# Altium schematic sheet DCDCConverterUP.SchDoc
size 420 x 297 mm; Address1: Address1; Address2: Address2; Address3: Address3; Address4: Address4; SheetNumber: 1; Scale: 1:1; Разраб.: Лепотенко; Обозначение документа: ЛАС.4276435.001Э3; Перв. применение: ЛАС.4276435.001; Наименование изделия 1: DC-DC преобразователь; Наименование изделия 2: Схема электрическая; Наименование изделия 3: принципиальная; Нач. отд.: Нач. отд.
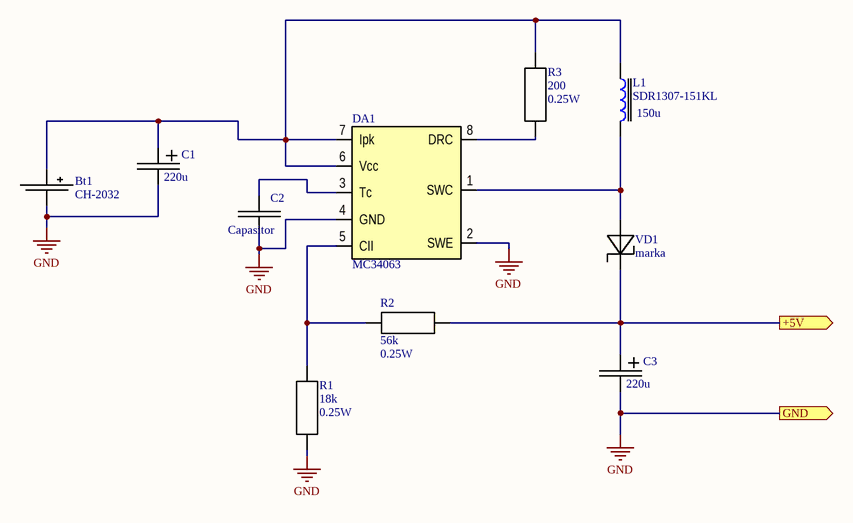
[diagram p0: DCDCConverterUP.SchDoc]

## Parts
Bt1  CH-2032  [CH25-2032]
C1  220u  [Type D]
C2  Capasitor  [CAP1206]
C3  220u  [Type D]
DA1  MC34063  [SO-8]
L1  SDR1307-151KL  value 150u  [SDR1307-151KL]
R1  value 18k  Power: 0.25W  [1206]  (hidden comment: Resistor)
R2  value 56k  Power: 0.25W  [1206]  (hidden comment: Resistor)
R3  value 200  Power: 0.25W  [1206]  (hidden comment: Resistor)
VD1  marka  [SOD-23]

## Ports
+5V (out), GND (out)

## Nets
GND: Bt1.2 C1.2 C2.2 C3.2 DA1.2(SWE) DA1.4(GND) R1.1 ; port GND
+5V: C3.1 R2.1 VD1.2 ; port +5V
NetBt1_1: Bt1.1 C1.1 DA1.6(Vcc) DA1.7(Ipk) L1.2 R3.2
NetC2_1: C2.1 DA1.3(Tc)
NetDA1_1: DA1.1(SWC) L1.1 VD1.1
NetDA1_5: DA1.5(CII) R1.2 R2.2
NetDA1_8: DA1.8(DRC) R3.1

## Notes on the sheet
- Перв. примен.
- Справ. №
- Подп. и дата
- Инв. № дубл.
- Взам. инв. №
- Разраб.
- Изм.
- Лист
- № докум.
- Подп.
- Дата
- Лит.
- Масса
- Масштаб
- Пров.
- Т.контр.
- Листов
- Инв. № подл.
- Утв.
- Н.контр.
- Копировал
- Формат А3

## Library data of the parts
Bt1 = CR-2032: Manufacturer: Comf; Value: CH25-CR2032; Quantity: 1; Part Number: CH25-2032; Package: CH25-2032; Price: 0.36; ShoppingPlace: http://belchip.by/product/?selected_product=12241
C1 C3 = Capasitor Electrolit: Part Number: T520D227M010ATE018; Manufacturer: Kemet; Power: 10V; Value: 220u; Price: 0.7; ShoppingPlace: http://belchip.by/product/?selected_product=19189; Package: TypeD; Quantity: 2
C2 = Capasitor: Part Number: 1206471X7R50V; Manufacturer: FAITHFULL LINK; Value: 0.47n; Voltage: 50V; Quantity: 1; Package: 1206; Price: 0.02; ShoppingPlace: http://belchip.by/product/?selected_product=00281
DA1 = MC34063: part Number: MC34063AG; Manufacturer: UTC; Value: 5V; Package: SO8; Price: 0.325; ShoppingPlace: http://belchip.by/product/?selected_product=18919; Quantity: 1
L1 = SDR1307-151KL: Manufacturer: BOURNS; Part Number: SDR1307-151KL; ShoppingPlace: http://belchip.by/product/?selected_product=06875; Price: 0.75; Package: SDR1307; Quantity: 1
R1 = Resistor: Manufacturer: China; Part Number: 1206183; Quntity: 2; Price: 0.15; Package: 1206; ShoppingPlace: http://belchip.by/product/?selected_product=01413
R2 = Resistor: Manufacturer: china; Part Number: 1206563; Quntity: 2; Price: 0.15; Package: 1206; ShoppingPlace: http://belchip.by/product/?selected_product=01425
R3 = Resistor: Manufacturer: China; Part Number: SMD12065221; Quntity: 20; Price: 1; Package: 1206; ShoppingPlace: http://belchip.by/product/?selected_product=01368
VD1 = DiodeShottki: part Number: 1N5819HW; Value: 1A; Power: 40V; Package: SOD-123; Quantity: 1; Price: 0.12; ShoppingPlace: http://belchip.by/product/?selected_product=08853